# EAGLE design Water level Detector (EAGLE 9.3.1)
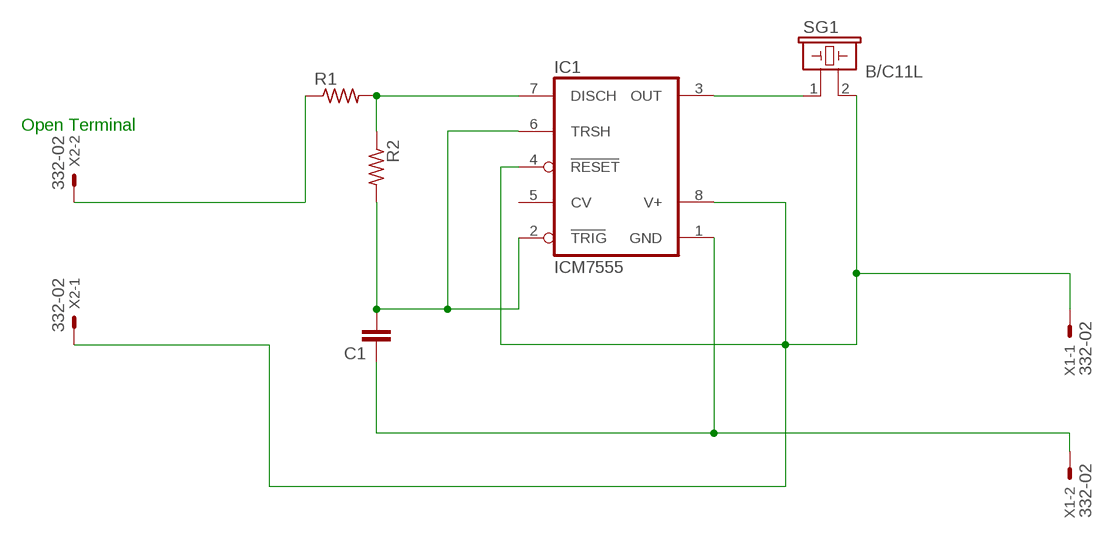
[diagram p0: schematic, sheet 1]

## Parts
C1  C5/2.5  [C5B2.5]
IC1  ICM7555  [DIL08]
R1  R-US_0204/7  [0204/7]
R2  R-US_0204/7  [0204/7]
SG1  B/C11L  [B/C11L]
X1  332-02  [332-02]
X2  332-02  [332-02]

## Nets
N$1: IC1.7(DISCH) R1.2 R2.1
N$2: C1.2 IC1.2(TRIG) IC1.6(TRSH) R2.2
N$3: R1.1 X2.2
N$4: IC1.4(RESET) IC1.8(V+) SG1.2 X1.1 X2.1
N$5: C1.1 IC1.1(GND) X1.2
N$6: IC1.3(OUT) SG1.1
Unconnected: IC1.5(CV)

## Notes on the sheet
- Open Terminal

## Library data of the parts
C1 = capacitor-wima:C: CAPACITOR naming: grid - package width
IC1 = maxim:ICM7555: TIMER; MF: MAXIM; MPN: ICM7555IPA+; OC_FARNELL: 9663762; OC_NEWARK: 68K4387
R1 R2 = adafruit:R-US_: RESISTOR, American symbol
SG1 = buzzer:B/C11L: BUZZER Source: Buerklin; OC_FARNELL: unknown; OC_NEWARK: unknown
X1 X2 = con-garry:332-02: 2 Pin - 2mm Dual Row Source: www.mpe-connector.de / garry_shortform_2012.pdf

## Board
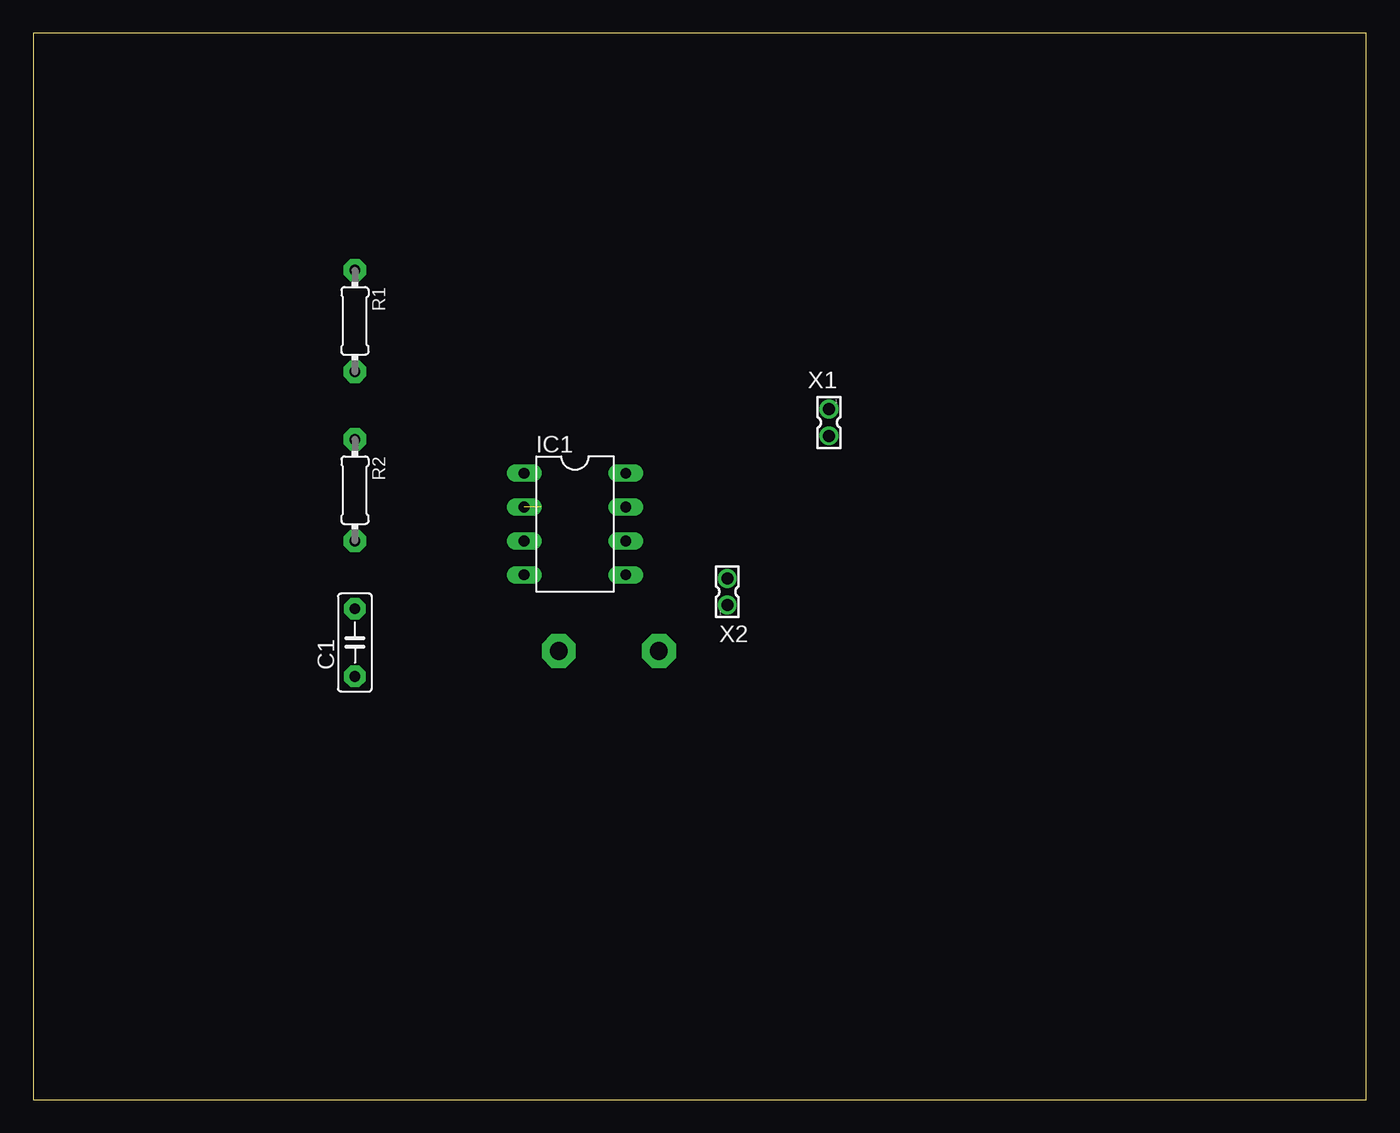
[diagram p1: board, top side]
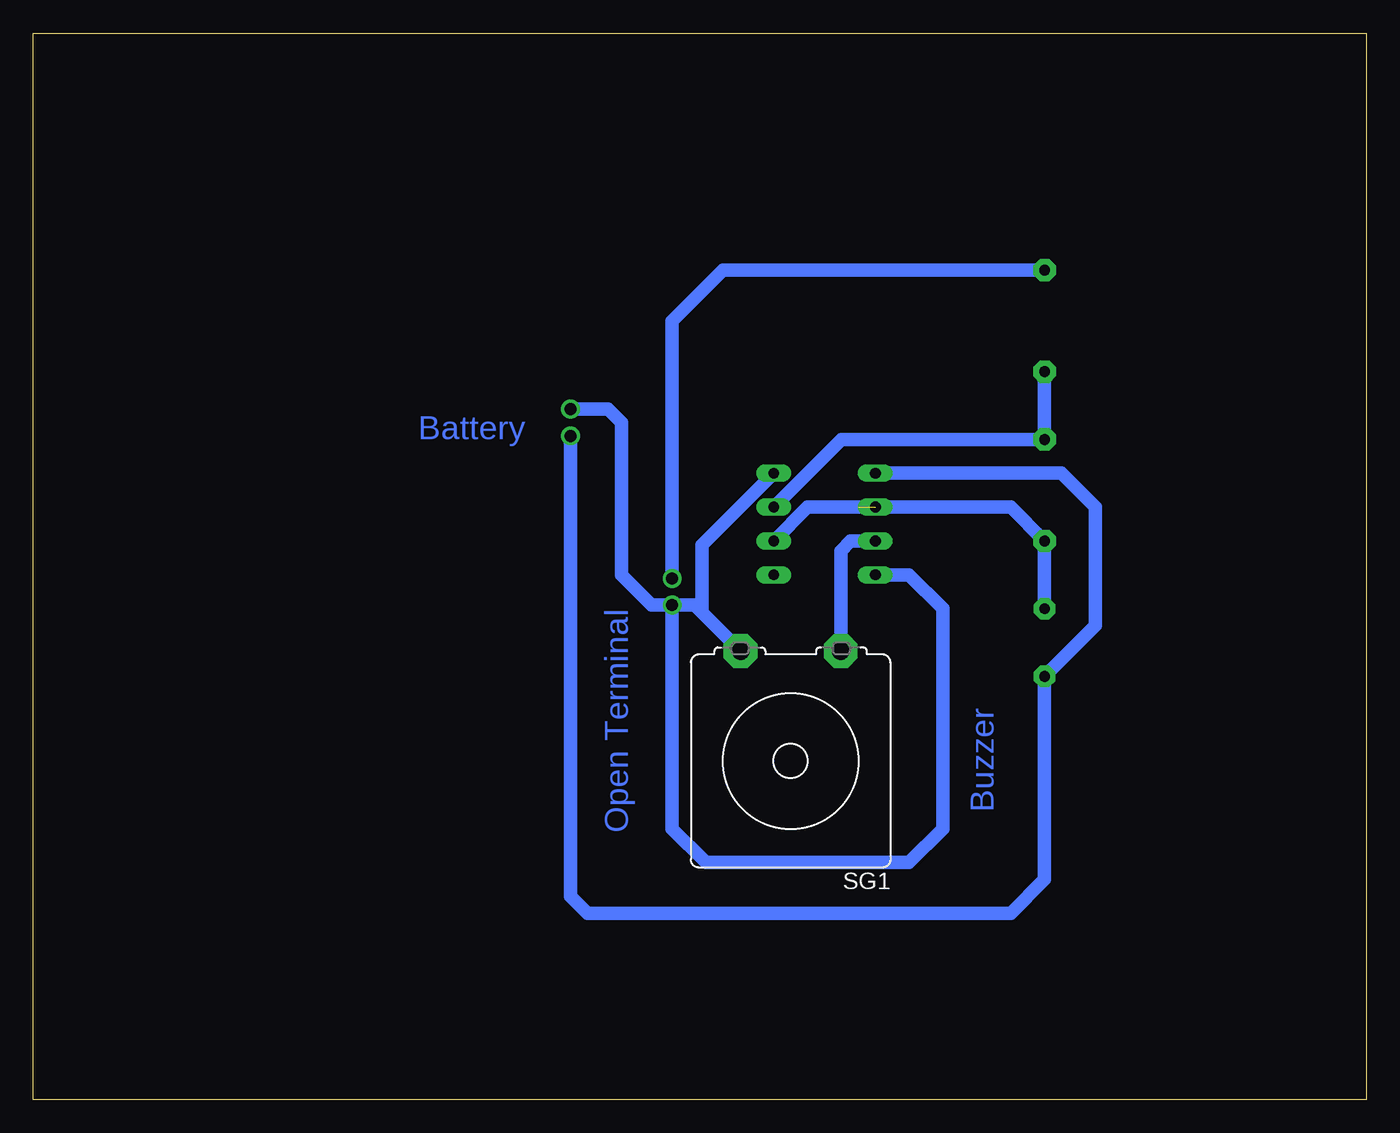
[diagram p2: board, bottom side, seen from below]

Size 100 x 80 mm. Coordinates in mm from the lower left corner, seen from the top.
Outline: 0,0 100,0 100,80 0,80 0,0
Copper layers (1*16): Top 0.035mm / dielectric 1.5mm / Bottom 0.035mm
Design rules "default": minimum track width 6mil, minimum drill 0.35mm, track to track 6mil, track to pad 6mil, pad to pad 6mil, via to via 6mil, smd to smd 6mil, copper to edge 40mil, drill to drill 6mil, minimum pad ring 10mil, minimum via ring 8mil, stop-mask expansion 4mil, vias tented up to drill 0mil, thermal gap 10mil

### Footprints (pad centres in the part's own frame; a part is rotated, then mirrored left to right if it is on the bottom)
C5B2.5 = drill 0.813 pad 1.6 octagon: 1 -2.54,0; 2 2.54,0
DIL08 = drill 0.813 long: 1 -3.81,-3.81; 2 -1.27,-3.81; 3 1.27,-3.81; 4 3.81,-3.81; 5 3.81,3.81; 6 1.27,3.81; 7 -1.27,3.81; 8 -3.81,3.81
0204/7 = drill 0.813 pad 1.676 octagon: 1 -3.81,0; 2 3.81,0
B/C11L = drill 1.321 pad 2.54 octagon: 1 -3.759,-8.255; 2 3.759,-8.255
332-02 = drill 0.9 pad 1.27: 1 0,-1; 2 0,1

### Placement (x,y rotation side)
C1  24.13,34.29 90 top
IC1  40.64,43.18 270 top
R1  24.13,58.42 270 top
R2  24.13,45.72 270 top
SG1  43.18,25.4 180 bottom
X1  59.69,50.8 180 top
X2  52.07,38.1 0 top

### Tracks (layer width: path | path; a pad name or v marks a point on that pad's centre or on a via)
N$1
  Bottom 1.016: R1.2 R2.1 39.37,49.53 IC1.7
N$2  (1 unrouted)
  Bottom 1.016: C1.2 R2.2 26.67,44.45 IC1.2 | IC1.6 41.91,44.45 38.1,44.45
N$3
  Bottom 1.016: X2.2 52.07,58.42 48.26,62.23 R1.1
N$4
  Bottom 1.016: X2.1 52.07,20.32 49.53,17.78 34.29,17.78 31.75,20.32 31.75,36.83 34.29,39.37 IC1.4 | SG1.2 49.82,36.54 | 49.82,36.54 50.38,37.1 X2.1 | X1.1 56.88,51.8 55.88,50.8 55.88,39.37 53.61,37.1 X2.1 | IC1.8 49.82,41.62 49.82,36.54
N$5
  Bottom 1.016: IC1.1 22.86,46.99 20.32,44.45 20.32,35.56 C1.1 24.13,16.51 26.67,13.97 58.42,13.97 59.69,15.24 X1.2
N$6
  Bottom 1.016: IC1.3 38.68,41.91 39.42,41.17 SG1.1

### Text on the board
Bottom: Battery | Open Terminal | Buzzer